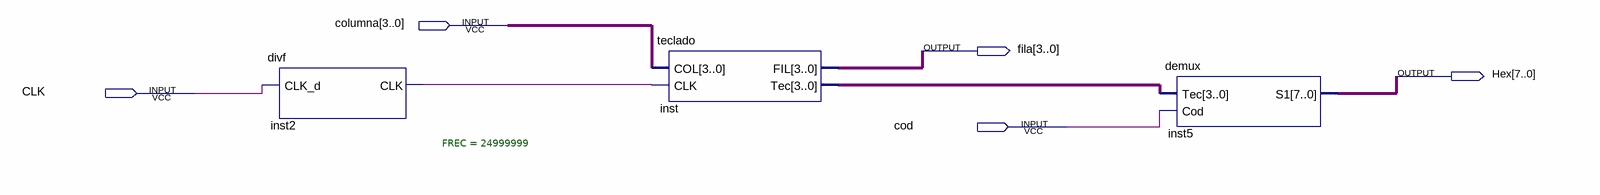
[diagram p0: schematic sheet]
// Quartus schematic practica2.bdf as structural Verilog: 3 symbols, 5 pins
module practica2 (
  input  [3:0] columna,
  input  CLK,
  input  cod,
  output [3:0] fila,
  output [7:0] Hex
);

  wire inst2_clk;
  wire [3:0] inst_tec;

  divf #(.FREC(24999999)) inst2 (.CLK_d(CLK), .CLK(inst2_clk));
  teclado inst (.COL(columna), .CLK(inst2_clk), .FIL(fila), .Tec(inst_tec));
  demux inst5 (.Tec(inst_tec), .Cod(cod), .S1(Hex));
endmodule
